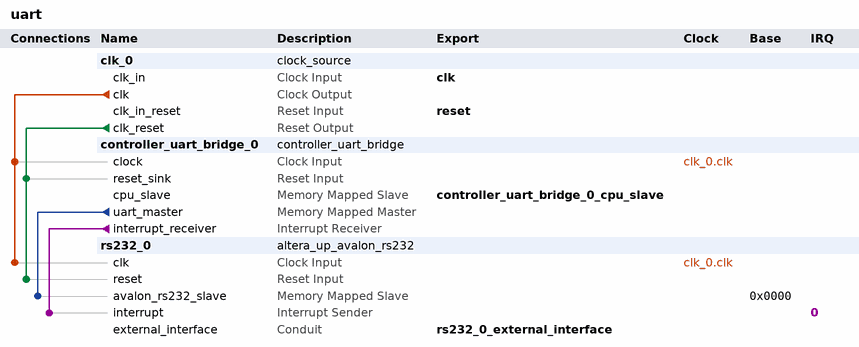
[diagram p0: system contents]
# Platform Designer (Qsys) system uart, Cyclone V 5CSEMA5F31C6
# Parameters at their usual value, and those the tool derives, are not listed.
package require -exact qsys 22.1
create_system uart
set_project_property DEVICE_FAMILY {Cyclone V}
set_project_property DEVICE 5CSEMA5F31C6

add_instance clk_0 clock_source 22.1
set_instance_parameter_value clk_0 clockFrequency 50000000

add_instance controller_uart_bridge_0 controller_uart_bridge 1.0

add_instance rs232_0 altera_up_avalon_rs232 17.1
set_instance_parameter_value rs232_0 baud 19910
set_instance_parameter_value rs232_0 parity None

# connections
add_connection clk_0.clk controller_uart_bridge_0.clock clock
add_connection clk_0.clk rs232_0.clk clock
add_connection clk_0.clk_reset controller_uart_bridge_0.reset_sink reset
add_connection clk_0.clk_reset rs232_0.reset reset
add_connection controller_uart_bridge_0.uart_master rs232_0.avalon_rs232_slave avalon
set_connection_parameter_value controller_uart_bridge_0.uart_master/rs232_0.avalon_rs232_slave baseAddress 0x0000
add_connection controller_uart_bridge_0.interrupt_receiver rs232_0.interrupt interrupt
set_connection_parameter_value controller_uart_bridge_0.interrupt_receiver/rs232_0.interrupt irqNumber 0

# exported interfaces
add_interface clk clock sink
set_interface_property clk EXPORT_OF clk_0.clk_in
add_interface controller_uart_bridge_0_cpu_slave avalon slave
set_interface_property controller_uart_bridge_0_cpu_slave EXPORT_OF controller_uart_bridge_0.cpu_slave
add_interface reset reset sink
set_interface_property reset EXPORT_OF clk_0.clk_in_reset
add_interface rs232_0_external_interface conduit end
set_interface_property rs232_0_external_interface EXPORT_OF rs232_0.external_interface

set_interconnect_requirement {$system} qsys_mm.clockCrossingAdapter HANDSHAKE
set_interconnect_requirement {$system} qsys_mm.enableEccProtection FALSE
set_interconnect_requirement {$system} qsys_mm.insertDefaultSlave FALSE
set_interconnect_requirement {$system} qsys_mm.maxAdditionalLatency 1

save_system uart.qsys
